# EasyEDA schematic Schema elettronico Bluetooth Switch.json
TITLE: Sheet_1; REV: 1.0; Date: 2023-11-22; Sheet: 1/1; Drawn By: Andrea Aghemo; Company: Your Company
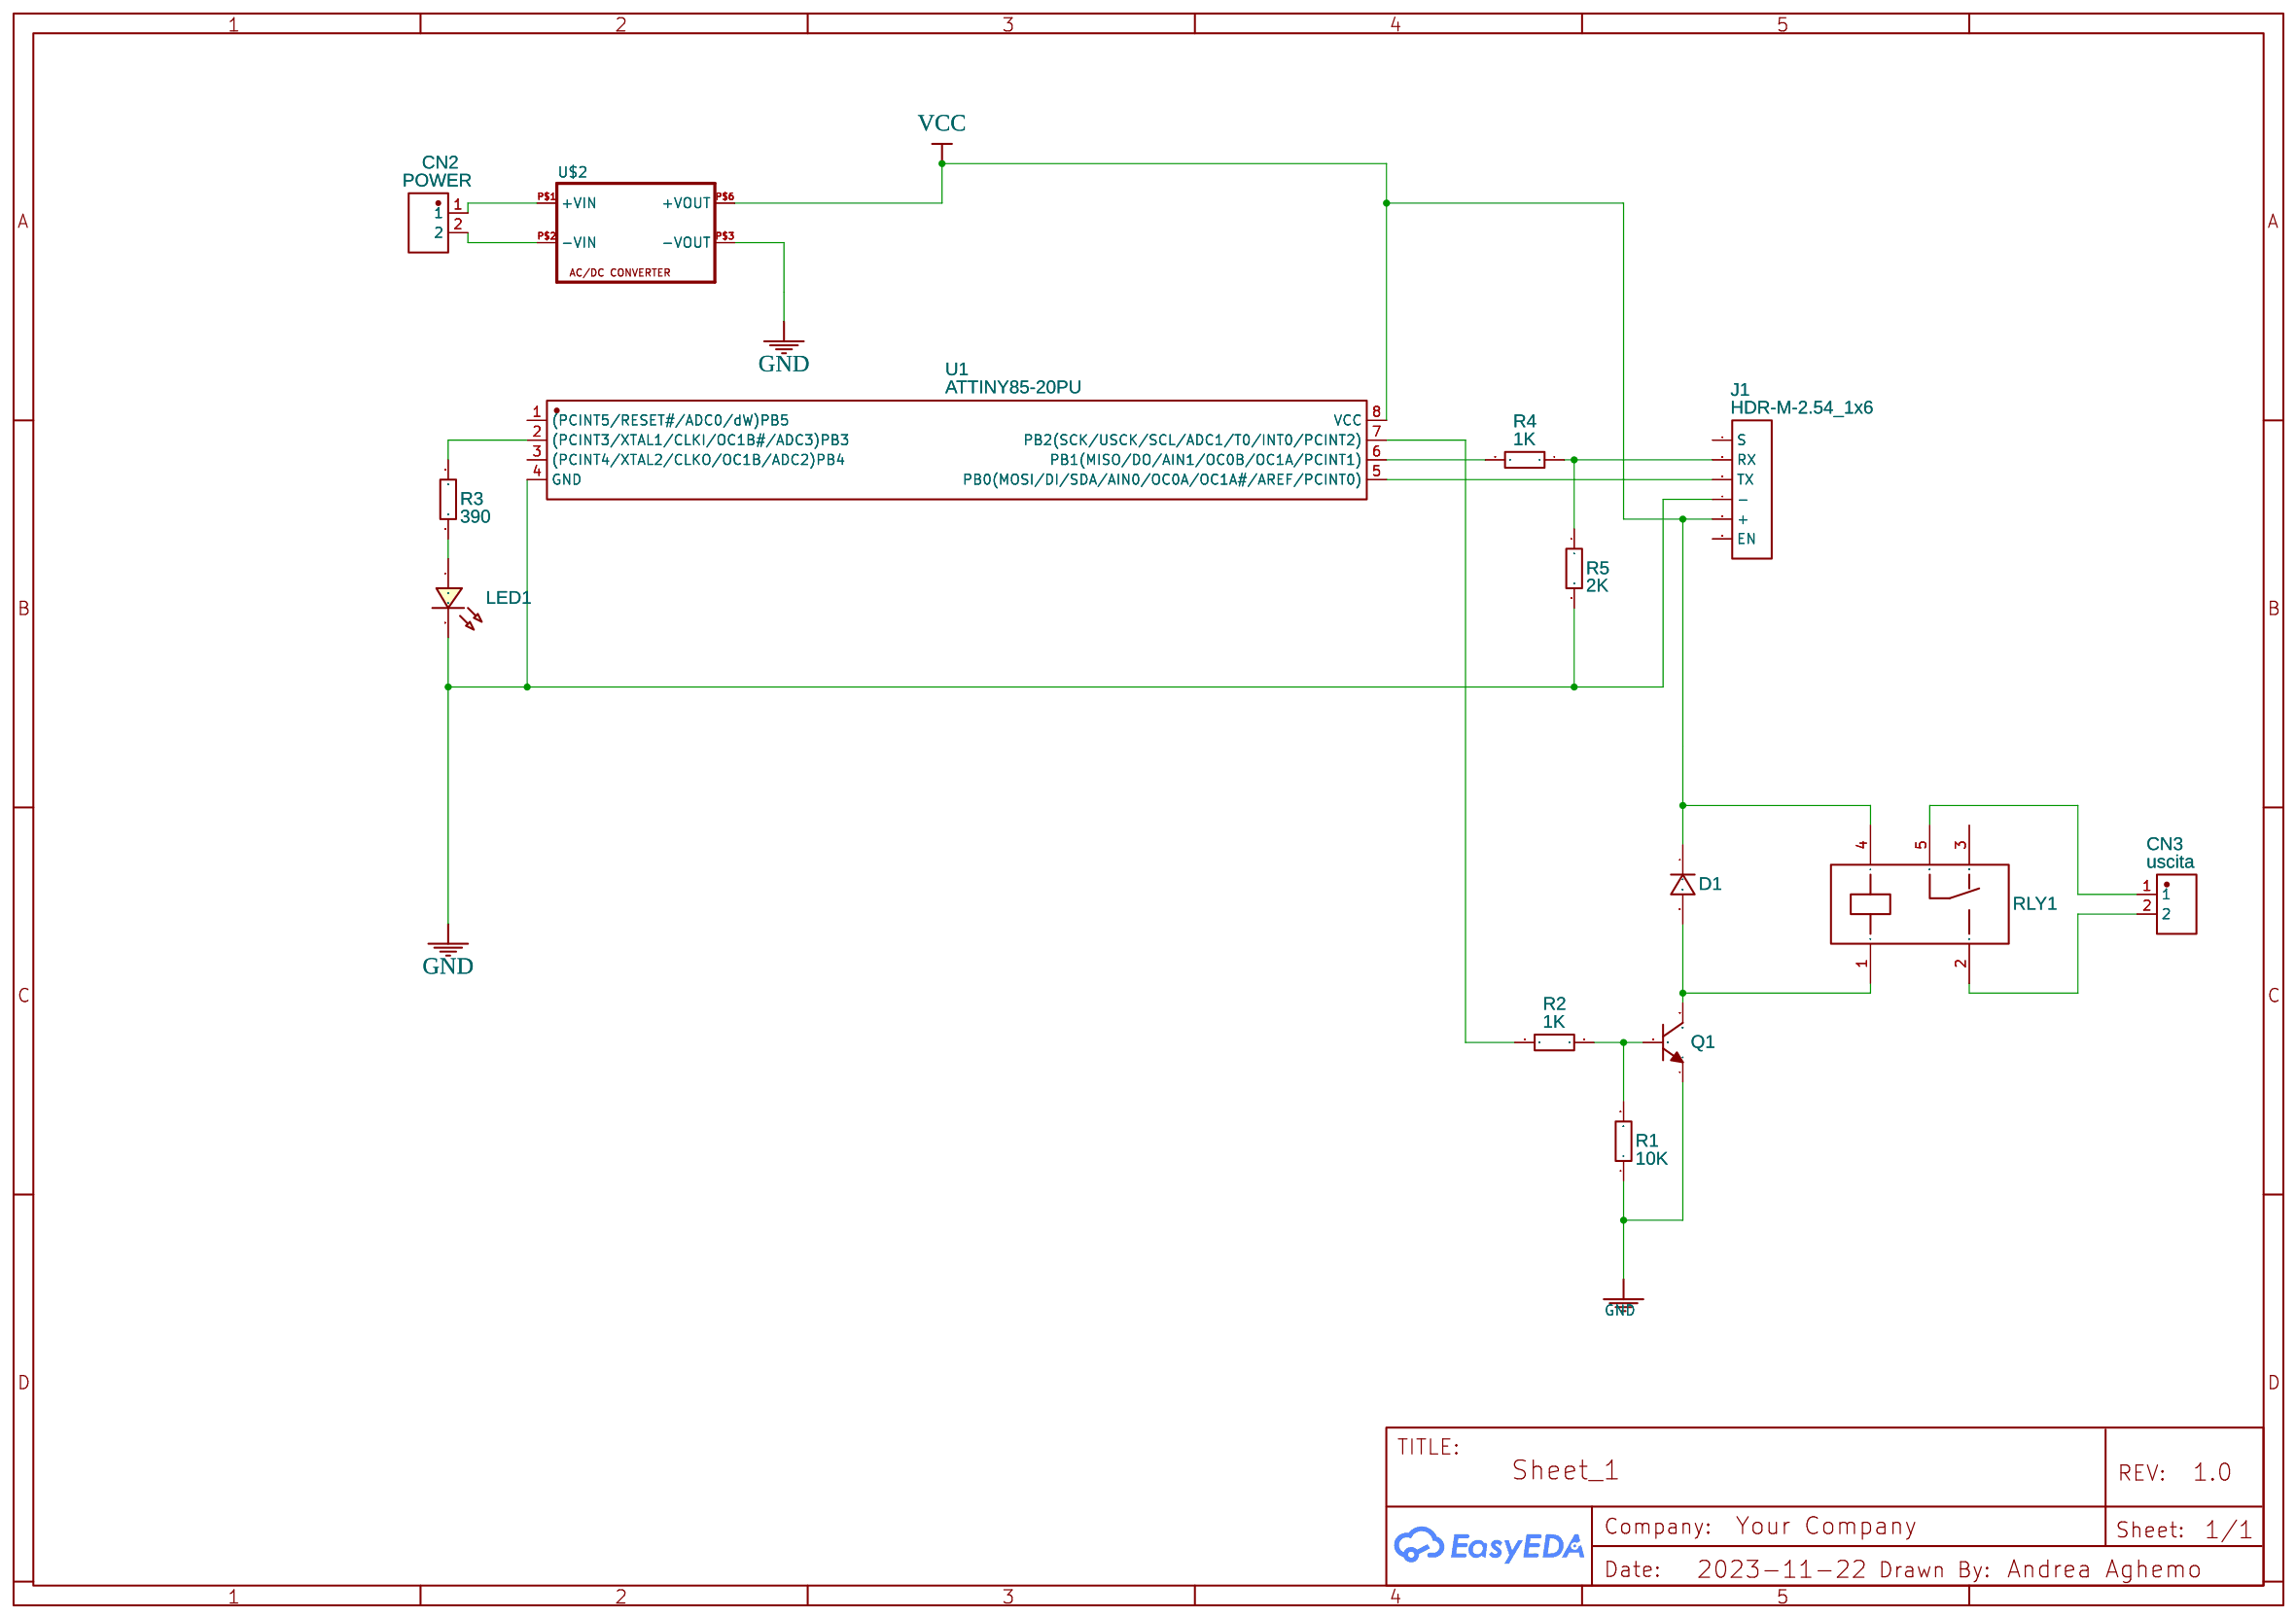
[diagram p0: schematic sheet]

## Parts
CN2  POWER  [CONN-TH_2P-P5.00_MX126-5.0-GN01-02P-CU-S-A]
CN3  uscita  [CONN-TH_2P-P5.00_MX126-5.0-GN01-02P-CU-S-A]
D1  1N4007  [SOD-123FL_L2.8-W1.8-LS3.7-RD-1]
J1  HDR-M-2.54_1x6  [HDR-M-2.54_1X6]
LED1  LED-0805_B  [LED0805_BLUE]
Q1  2N3904  [SOT-23-3_L2.9-W1.3-P1.90-LS2.4-TR]
R1  10K  [R0603]
R2  1K  [R0603]
R3  390  [R0603]
R4  1K  [R0603]
R5  2K  [R0603]
RLY1  SRD-05VDC-SL-C  [RELAY-TH_SRD-XXVDC-XL-C]
U1  ATTINY85-20PU  [PDIP-8_L9.3-W6.4-P2.54-LS7.9-BL-1]
U$2  AC-DC-CONVERTER_SUCA11  [AC-DC-CONVERTER2]

## Library data of the parts
CN2 CN3 = MX126-5.0-GN01-02P-CU-S-A: Supplier: LCSC; Supplier Part: C5188434; Manufacturer: MAX(迈旭); Manufacturer Part: MX126-5.0-GN01-02P-Cu-S-A; JLCPCB Part Class: Extended Part; Contributor: lcsc; link: https://lcsc.com/eda_search?q=C5188434&%26type=1&ref=editor
D1 = 1N4007-SOD123: Contributor: LCSC; Supplier: LCSC; Supplier Part: C9900003500; Manufacturer: null; JLCPCB Part Class: Extended Part; link: https://lcsc.com/eda_search?q=C9900003500&%26type=1&ref=editor
J1 = HDR-M-2.54_1x6: Supplier Part: C190819; Supplier: LCSC; Contributor: LCEDA_Lib
LED1 = LED-0805_B: Manufacturer: 方舟 ARKLED; Manufacturer Part: D-B080508B1-KS2; Supplier Part: C108412; Contributor: LCEDA_Lib
Q1 = 2N3904(SOT-23): Supplier: LCSC; Manufacturer: KEC; Manufacturer Part: 2n3904S-RTK/PS; Supplier Part: C18536; Paste Type: SOT-23; Contributor: LCEDA_Lib
R1-R5 = RK73B1JTTD103J: Supplier: LCSC; Manufacturer: KOA; Contributor: LCSC; Supplier Part: C159891
RLY1 = SRD-05VDC-SL-C: Supplier: LCSC; Manufacturer: 松乐; Supplier Part: C35449; JLCPCB Part Class: Extended Part; link: https://lcsc.com/eda_search?q=C35449&%26type=1&ref=editor
U1 = ATTINY85-20PU: Contributor: LCSC; Supplier: LCSC; Supplier Part: C965497; Manufacturer: MICROCHIP(美国微芯); JLCPCB Part Class: Extended Part; link: https://lcsc.com/eda_search?q=C965497&%26type=1&ref=editor

## Nets
GND: J1.4(-) LED1.2 Q1.1(E) R1.1 R5.2 U1.4(GND) U$2.P$3(-VOUT)
VCC: D1.1 J1.5(+) RLY1.4 U1.8(VCC) U$2.P$6(+VOUT)
Net-(CN2-1): CN2.1 U$2.P$1(+VIN)
Net-(CN2-2): CN2.2 U$2.P$2(-VIN)
Net-(CN3-1): CN3.1 RLY1.5
Net-(CN3-2): CN3.2 RLY1.2
Net-(D1-2): D1.2 Q1.3(C) RLY1.1
Net-(J1-2): J1.2(RX) R4.1 R5.1
Net-(J1-3): J1.3(TX) U1.5(PB0(MOSI/DI/SDA/AIN0/OC0A/OC1A#/AREF/PCINT0))
Net-(LED1-1): LED1.1 R3.1
Net-(Q1-2): Q1.2(B) R1.2 R2.1
Net-(R2-2): R2.2 U1.7(PB2(SCK/USCK/SCL/ADC1/T0/INT0/PCINT2))
Net-(R3-2): R3.2 U1.2((PCINT3/XTAL1/CLKI/OC1B#/ADC3)PB3)
Net-(R4-2): R4.2 U1.6(PB1(MISO/DO/AIN1/OC0B/OC1A/PCINT1))

Not connected (* = marked no-connect by the designer): J1 1(S) 6(EN); RLY1 3; U1 1((PCINT5/RESET#/ADC0/dW)PB5) 3((PCINT4/XTAL2/CLKO/OC1B/ADC2)PB4)
